# Altium project SUBBOARD-EMC_input.PrjPcb
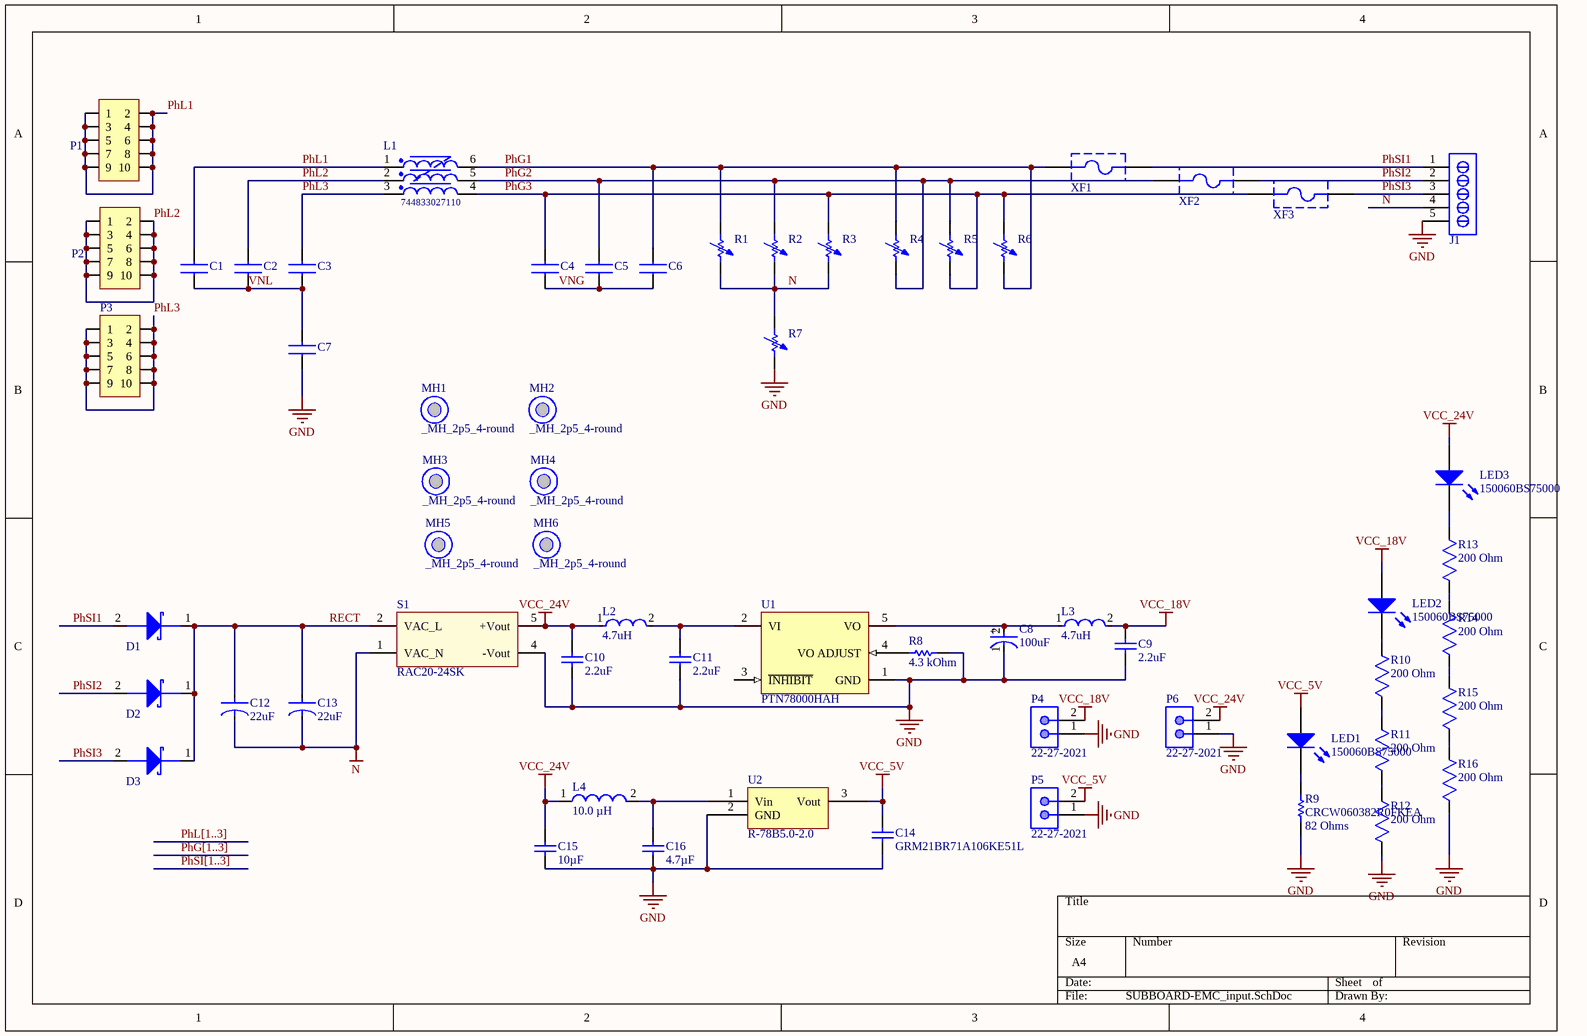
[diagram p0: SUBBOARD-EMC_input.SchDoc]
1 sheet, 61 parts. Net scope: global (net labels, ports and power ports of the same name join across sheets).
Board file: SUBBOARD-EMC_input.PcbDoc

## Sheet SUBBOARD-EMC_input.SchDoc
size A4

### Parts
C1  PHE840MZ7100MF11R06L2  [PHE840MZ7100MF11R06L2]  (value not drawn)
C2  PHE840MZ7100MF11R06L2  [PHE840MZ7100MF11R06L2]  (value not drawn)
C3  PHE840MZ7100MF11R06L2  [PHE840MZ7100MF11R06L2]  (value not drawn)
C4  PHE840MZ7100MF11R06L2  [PHE840MZ7100MF11R06L2]  (value not drawn)
C5  PHE840MZ7100MF11R06L2  [PHE840MZ7100MF11R06L2]  (value not drawn)
C6  PHE840MZ7100MF11R06L2  [PHE840MZ7100MF11R06L2]  (value not drawn)
C7  PHE850ER7100MR03R06L2  [PHE850ER7100MR03R06L2]  (value not drawn)
C8  Capacitance: 100uF  [FP-EEE-FK1H101P-MFG]  (hidden comment: EEE-FK1H101P)
C9  Capacitance: 2.2uF  [CAPC3225X140X50ML20T25]  (hidden comment: C1210C225K5RACTU)
C10  Capacitance: 2.2uF  [CAPC3225X140X50ML20T25]  (hidden comment: C1210C225K5RACTU)
C11  Capacitance: 2.2uF  [CAPC3225X140X50ML20T25]  (hidden comment: C1210C225K5RACTU)
C12  Capacitance: 22uF  [EEV-EB2W220M]  (hidden comment: EEV-EB2W220M)
C13  Capacitance: 22uF  [EEV-EB2W220M]  (hidden comment: EEV-EB2W220M)
C14  GRM21BR71A106KE51L  [CAPC2013X140X45NL15T25]
C15  Capacitance: 10µF  [CAPC3225X270X60LL30T30]  (hidden comment: UMK325BJ106KM-T)
C16  Capacitance: 4.7µF  [CAPC3216X180X55LL20T30]  (hidden comment: UMK316AB7475KL-T)
D1  BYG23T-M3/TR  [BYG23T-M3/TR]  (value not drawn)
D2  BYG23T-M3/TR  [BYG23T-M3/TR]  (value not drawn)
D3  BYG23T-M3/TR  [BYG23T-M3/TR]  (value not drawn)
J1  1715750  [SHDR5W110P0X500_1X5_2532X980X1380P]  (value not drawn)
L1  744833027110  [WE-TPB_Type 3XL_744833027110]
L2  Inductance: 4.7uH  [FP-IHLP-1616BZ-FP_1_8545x-MFG]  (hidden comment: IHLP1616BZER4R7M11)
L3  Inductance: 4.7uH  [FP-IHLP-1616BZ-FP_1_8545x-MFG]  (hidden comment: IHLP1616BZER4R7M11)
L4  Inductance: 10.0 µH  [WE-PD-M-PB]  (hidden comment: 744777910)
LED1  150060BS75000  [0603_A]
LED2  150060BS75000  [0603_A]
LED3  150060BS75000  [0603_A]
MH1  _MH_2p5_4-round  [_MH_2p5_4-round]
MH2  _MH_2p5_4-round  [_MH_2p5_4-round]
MH3  _MH_2p5_4-round  [_MH_2p5_4-round]
MH4  _MH_2p5_4-round  [_MH_2p5_4-round]
MH5  _MH_2p5_4-round  [_MH_2p5_4-round]
MH6  _MH_2p5_4-round  [_MH_2p5_4-round]
P1  IPT1-105-01-S-D-RA  [IPT1-105-01-S-D-RA]  (value not drawn)
P2  IPT1-105-01-S-D-RA  [IPT1-105-01-S-D-RA]  (value not drawn)
P3  IPT1-105-01-S-D-RA  [IPT1-105-01-S-D-RA]  (value not drawn)
P4  22-27-2021  [MOLX-22-27-2021_V]
P5  22-27-2021  [MOLX-22-27-2021_V]
P6  22-27-2021  [MOLX-22-27-2021_V]
R1  VDRS07H300BSE  [VISH-VDRS07-53x22-2_V]  (value not drawn)
R2  VDRS07H300BSE  [VISH-VDRS07-53x22-2_V]  (value not drawn)
R3  VDRS07H300BSE  [VISH-VDRS07-53x22-2_V]  (value not drawn)
R4  VDRS07H300BSE  [VISH-VDRS07-53x22-2_V]  (value not drawn)
R5  VDRS07H300BSE  [VISH-VDRS07-53x22-2_V]  (value not drawn)
R6  VDRS07H300BSE  [VISH-VDRS07-53x22-2_V]  (value not drawn)
R7  VDRS07H300BSE  [VISH-VDRS07-53x22-2_V]  (value not drawn)
R8  value 4.3 kOhm  [RESC2013X60X40LL20T25]  (hidden comment: ERA6AEB432V)
R9  CRCW060382R0FKEA  value 82 Ohms  [RESC1609X50X30LL10T20]
R10  200 Ohm  [CRCW0603200RFKEAHP]
R11  200 Ohm  [CRCW0603200RFKEAHP]
R12  200 Ohm  [CRCW0603200RFKEAHP]
R13  200 Ohm  [CRCW0603200RFKEAHP]
R14  200 Ohm  [CRCW0603200RFKEAHP]
R15  200 Ohm  [CRCW0603200RFKEAHP]
R16  200 Ohm  [CRCW0603200RFKEAHP]
S1  RAC20-24SK  [RAC20-K]
U1  PTN78000HAH  [EUS0005A]
U2  R-78B5.0-2.0  [R-78B5.0-2.0]
XF1  696108003002  [696108003002]  (value not drawn)
XF2  696108003002  [696108003002]  (value not drawn)
XF3  696108003002  [696108003002]  (value not drawn)

### Nets
GND: C7.2 C8.1(C) C9.2 C10.2 C11.2 C14.1 C15.2 C16.2 J1.5 P4.1 P5.1 P6.1 R7.2 R8.1 R9.2 R12.1 R16.1 S1.4(-Vout) U1.1(GND) U2.2(GND)
N: C12.2 C13.2 J1.4 R1.2 R2.2 R3.2 R7.1 S1.1(VAC_N)
VCC_5V: C14.2 LED1.2(A) P5.2 U2.3(Vout)
VCC_18V: C9.1 L3.2 LED2.2(A) P4.2
VCC_24V: C10.1 C15.1 L2.1 L4.1 LED3.2(A) P6.2 S1.5(+Vout)
PhG1: C6.1 L1.6 R1.1 R4.1 R6.2 XF1.1
PhG2: C5.1 L1.5 R2.1 R4.2 R5.1 XF2.1
PhG3: C4.1 L1.4 R3.1 R5.2 R6.1 XF3.1
PhL1: C1.1 L1.1 P1.1 P1.2 P1.3 P1.4 P1.5 P1.6 P1.7 P1.8 P1.9 P1.10
PhL2: C2.1 L1.2 P2.1 P2.2 P2.3 P2.4 P2.5 P2.6 P2.7 P2.8 P2.9 P2.10
PhL3: C3.1 L1.3 P3.1 P3.2 P3.3 P3.4 P3.5 P3.6 P3.7 P3.8 P3.9 P3.10
PhSI1: D1.2(Anode) J1.1 XF1.2
PhSI2: D2.2(Anode) J1.2 XF2.2
PhSI3: D3.2(Anode) J1.3 XF3.2
RECT: C12.1 C13.1 D1.1(Cathode) D2.1(Cathode) D3.1(Cathode) S1.2(VAC_L)
VNG: C4.2 C5.2 C6.2
VNL: C1.2 C2.2 C3.2 C7.1
NetC8_2: C8.2(A) L3.1 U1.5(VO)
NetC11_1: C11.1 L2.2 U1.2(VI)
NetC16_1: C16.1 L4.2 U2.1(Vin)
NetLED1_1: LED1.1(K) R9.1
NetLED2_1: LED2.1(K) R10.2
NetLED3_1: LED3.1(K) R13.2
NetR8_2: R8.2 U1.4(VO_ADJUST)
NetR10_1: R10.1 R11.2
NetR11_1: R11.1 R12.2
NetR13_1: R13.1 R14.2
NetR14_1: R14.1 R15.1
NetR15_2: R15.2 R16.2

Not connected (* = marked no-connect by the designer): U1 3(~{INHIBIT})

### Buses and harness runs
bus PhG[1..3]
bus PhL[1..3]
bus PhSI[1..3]

### Notes on the sheet
- (in symbol CMP-05427-000005-1) +

### Library data of the parts
C1-C6 = PHE840MZ7100MF11R06L2: CAP FILM 1UF 20% 760VDC RADIAL; Manufacturer: KEMET; Dielectric Material: PP; Voltage: 760V; Dissipation Factor: 0.4%; Voltage Rating (AC): 280V; Lead Length: 30mm; Lead Diameter: 0.8mm; Manufacturer Part Number: PHE840MZ7100MF11R06L2; RoHS: Yes; Category: Film Capacitors; Stock 1: 496; Pricing 1: 1=2,83000, 10=2,28500, 50=1,99440, 100=1,74500, 500=1,32954, 1000=1,16335, 2500=1,12180, 5000=1,09338 (USD); Mount: Through Hole; Case/Package: Radial; Number of Pins: 2; Min Operating Temperature: -55°C; Max Operating Temperature: 105°C; Dielectric: PP; Termination: Radial; Capacitance: 1uF; Tolerance: 20%; Packaging: Tray; Package Quantity: 216; Voltage Rating (DC): 760V; Length: 31.5mm; Height: 20.5mm; Lead Pitch: 27.5mm; Height - Seated (Max): 0.807inch; Depth: 10.5mm; Width: 0.413inch; Radiation Hardening: No; ComponentLink1URL: https://datasheet.ciiva.com/241/phe840m20series-241827.pdf?src-supplier=Digi-Key; ComponentLink1Description: https://datasheet.ciiva.com/241/phe840m20series-241827.pdf?src-supplier=Digi-Key; ComponentLink2URL: https://datasheet.ciiva.com/17239/datasheetpn-f840fe105m275c-17239253.pdf?src-supplier=Avnet+Europe; ComponentLink2Description: https://datasheet.ciiva.com/17239/datasheetpn-f840fe105m275c-17239253.pdf?src-supplier=Avnet+Europe; ComponentLink3URL: https://datasheet.ciiva.com/14589/70096376-14589271.pdf?src-supplier=Allied+Electronics; ComponentLink3Description: https://datasheet.ciiva.com/14589/70096376-14589271.pdf?src-supplier=Allied+Electronics; ComponentLink4URL: https://datasheet.ciiva.com/13403/f3294-phe840m-540905-13403690.pdf?src-supplier=Mouser; ComponentLink4Description: https://datasheet.ciiva.com/13403/f3294-phe840m-540905-13403690.pdf?src-supplier=Mouser; Supplier 1: Digi-Key; Supplier 2: Newark; Supplier 3: Arrow; Supplier 4: Mouser; Supplier 5: Allied Electronics; Supplier Part Number 5: 70096381; Supplier Part Number 4: 80-PHE840MZ7100MF11R; Supplier Part Number 3: PHE840MZ7100MF11R06L2; Supplier Part Number 2: 61M2385; Supplier Part Number 1: 399-5431-ND
C7 = PHE850ER7100MR03R06L2: CAP FILM 1UF 20% 1.25KVDC RADIAL; Manufacturer: KEMET; Dielectric Material: PP; Voltage Rating (AC): 300V; Voltage Rating (DC): 1.25kV; Lead Diameter: 1mm; Manufacturer Part Number: PHE850ER7100MR03R06L2; RoHS: Yes; Category: Film Capacitors; Stock 1: 10227; Pricing 1: 1=5,26000, 10=4,73700, 50=4,10560, 100=3,57930, 500=2,94768, 1000=2,77038 (USD); Mount: Through Hole; Case/Package: Radial; Min Operating Temperature: -55°C; Max Operating Temperature: 110°C; Dielectric: PP; Termination: Radial; Capacitance: 1uF; Tolerance: 20%; Packaging: Tray; Voltage: 1.25kV; Package Quantity: 91; Voltage Rating: 300V; Length: 41mm; Height: 19mm; Lead Pitch: 37.5mm; Width: 36mm; Height - Seated (Max): 1.417inch; Depth: 19mm; Radiation Hardening: No; Lead Free: Lead Free; ComponentLink1URL: https://datasheet.ciiva.com/11791/0900766b807a221a-11791526.pdf?src-supplier=RSComponents; ComponentLink1Description: https://datasheet.ciiva.com/11791/0900766b807a221a-11791526.pdf?src-supplier=RSComponents; ComponentLink2URL: https://datasheet.ciiva.com/241/f3294-phe850-241880.pdf?src-supplier=Digi-Key; ComponentLink2Description: https://datasheet.ciiva.com/241/f3294-phe850-241880.pdf?src-supplier=Digi-Key; Supplier 1: Digi-Key; Supplier 2: RSComponents; Supplier 3: Mouser; Supplier Part Number 2: 6168017; Supplier Part Number 1: 399-5425-ND; Supplier Part Number 3: 80-PHE850ER7100MR03
C8 = CMP-05427-000005-1: CAP ALUM 100UF 20% 50V SMD; Manufacturer: Panasonic Electronic Components; Automotive Grade: Grade 2; Dissipation Factor: 10%; Life: 2000Hours; Ripple Current: 350mA; Material: Aluminum; Esr: 0.34Ω; Leakage Current: 50uA; Tolerance: 20%; Package: 0; ComponentLink2URL: https://industrial.panasonic.com/cdbs/www-data/pdf/RDE0000/ABA0000C1181.pdf; Manufacturer Part Number: EEE-FK1H101P; Temperature Range Low: -55°C; Voltage Rating: 50V; ComponentLink2Description: Datasheet; Category: Cap; Digikey Description: CAP ALUM 100UF 20% 50V SMD; Octopart: https://octopart.com/eeefk1h101p-panasonic-4642841; Automotive: Yes; Temperature: -55°C to +105°C; Lead Free: Yes; Mouser Description: Cap Aluminum Lytic 100uF 50V 20% (8 X 10.2mm) SMD 350mA 2000h 105C Automotive T/R; Height: 10.5mm; Device Class L3: Aluminum Electrolytic Capacitors; Value: 100uF; Device Class L1: Passive Components; RoHS: TRUE; Device Class L2: Capacitors; Temperature Range High: +105°C
C9-C11 = CMP-2000-06019-1: Chip Capacitor, 2.2 uF, +/- 10%, 50 V, -55 to 125 degC, 1210 (3225 Metric), RoHS, Tape and Reel; Manufacturer: Kemet; Dielectric: X7R; Voltage Rating: 50V; Type: SMDMLCCX7R6.3-250VDCCommericalGrade; Capacitance - nF: 2200nF; Case Height: 1.25mm; Case Width: 2.5mm; Class: Class1; Case Length: 3.2mm; Temperature Coefficient / Code: +/-15%; Manufacturer URL: http://www.kemet.com/; Series: C1210C; Mounting Technology: SurfaceMount; Case Code - in: 1210; Factory Pack Quantity: 2500; Package Reference: 1210; Product: GeneralTypeMLCCs; Datasheet Version: 02/2016; Datasheet URL: http://www.kemet.com/docfinder?Partnumber=C1210C225K5RACTU; Case Code - mm: 3225; Minimum Operating Temperature: -55C; Voltage Rating DC: 50V; Maximum Operating Temperature: +125C; Termination Style: SMD/SMT; Tolerance: 10%; Dimensions: 2.5mmWx3.2mmLx1.25mmH; Operating Temperature Range: -55Cto+125C; Product Category: MultilayerCeramicCapacitorsMLCC-SMD/SMT; Package / Case: 1210(3225metric); RoHS: Details; Package Description: 2-Pin Surface Mount Device, Body 3.2 x 2.5 mm; Brand: Kemet; Packaging: Reel
C12 C13 = EEV-EB2W220M: CAP, ALU ELEC, 22UF, 450V, SMD; Manufacturer: Panasonic; Dielectric Material: Aluminium; Tolerance: 20%; Ripple Current: 560mA; Life (Hours): 5000Hour; Leakage Current: 604uA; Lead Length: 6.7mm; Manufacturer Part Number: EEV-EB2W220M; RoHS: Yes; Category: Aluminum Electrolytic Capacitors; Stock 1: 806; Pricing 1: 1=3,73000, 10=3,00800 (USD); Mount: Surface Mount,PCB; Case/Package: Radial; Number of Pins: 21; Min Operating Temperature: -25°C; Max Operating Temperature: 105°C; Packaging: Tape and Reel; Voltage Rating: 450V; Voltage Rating (DC): 450V; Termination: SMD/SMT; Package Quantity: 1; Voltage: 450V; Ripple Current (AC): 560mA; Diameter: 18mm; Length: 21.5mm; Height: 21.5mm; Height - Seated (Max): 0.846inch; Lead Pitch: 6.7mm; Width: 1.2mm; Radiation Hardening: No; REACH SVHC: No SVHC; Lead Free: Lead Free; ComponentLink1URL: https://datasheet.ciiva.com/94/aba0000ce11-94804.pdf?src-supplier=Digi-Key; ComponentLink1Description: https://datasheet.ciiva.com/94/aba0000ce11-94804.pdf?src-supplier=Digi-Key; ComponentLink2URL: https://datasheet.ciiva.com/94/aba0000ce11-94805.pdf?src-supplier=Digi-Key; ComponentLink2Description: https://datasheet.ciiva.com/94/aba0000ce11-94805.pdf?src-supplier=Digi-Key; ComponentLink3URL: https://datasheet.ciiva.com/26823/getdatasheetpartid-52298-26823205.pdf?src-supplier=Verical; ComponentLink3Description: https://datasheet.ciiva.com/26823/getdatasheetpartid-52298-26823205.pdf?src-supplier=Verical; ComponentLink4URL: https://datasheet.ciiva.com/94/aba0000ce11-94806.pdf?src-supplier=Digi-Key; ComponentLink4Description: https://datasheet.ciiva.com/94/aba0000ce11-94806.pdf?src-supplier=Digi-Key; ComponentLink5URL: https://datasheet.ciiva.com/14594/70257799-14594134.pdf?src-supplier=Allied+Electronics; ComponentLink5Description: https://datasheet.ciiva.com/14594/70257799-14594134.pdf?src-supplier=Allied+Electronics; ComponentLink6URL: https://datasheet.ciiva.com/8081/aba0000ce11-8081608.pdf?src-supplier=Element14; ComponentLink6Description: https://datasheet.ciiva.com/8081/aba0000ce11-8081608.pdf?src-supplier=Element14; ComponentLink7URL: https://datasheet.ciiva.com/46379/1678957-46379208.pdf?src-supplier=Element14; ComponentLink7Description: https://datasheet.ciiva.com/46379/1678957-46379208.pdf?src-supplier=Element14; ComponentLink8URL: https://datasheet.ciiva.com/14603/70257799-14603849.pdf?src-supplier=Allied+Electronics; ComponentLink8Description: https://datasheet.ciiva.com/14603/70257799-14603849.pdf?src-supplier=Allied+Electronics; ComponentLink9URL: https://datasheet.ciiva.com/31418/1678957-31418299.pdf?src-supplier=Farnell; ComponentLink9Description: https://datasheet.ciiva.com/31418/1678957-31418299.pdf?src-supplier=Farnell; ComponentLink10URL: https://datasheet.ciiva.com/46372/1678957-46372111.pdf?src-supplier=Element14; ComponentLink10Description: https://datasheet.ciiva.com/46372/1678957-46372111.pdf?src-supplier=Element14; Supplier 1: Digi-Key; Supplier 2: Digi-Key; Supplier 3: Digi-Key; Supplier 4: Newark; Supplier 5: Mouser; Supplier 6: Farnell; Supplier Part Number 6: 2326352; Supplier Part Number 5: 667-EEV-EB2W220M; Supplier Part Number 4: 85Y5181; Supplier Part Number 3: PCE3598TR-ND; Supplier Part Number 2: PCE3598DKR-ND; Supplier Part Number 1: PCE3598CT-ND
C14 = CMP-2007-03395-1: Manufacturer: Murata; Part Number: GRM21BR71A106KE51L
C15 = CMP-2000-07360-1: Chip Capacitor, 10 uF, +/- 10%, 50 V, -55 to 85 degC, 1210 (3225 Metric), RoHS, Tape and Reel; Manufacturer: Taiyo Yuden; Catalog Drawings: xMKSeries_1210_2.5; Other Names: 587-2247-2CEUMK325BJ106KM-TQ4177041UMK325BJ106KM-T-NDUMK325BJ106KMT; Online Catalog: MSeries; Voltage - Rated: 50V; Temperature Coefficient: X5R; Tolerance: ±10%; Packaging: Tape&Reel(TR); Features: -; Applications: GeneralPurpose; Series: M; Manufacturer URL: http://www.t-yuden.com/; Package Description: 2-Pin Surface Mount Device, Body 3.2 x 2.5 mm; Package Reference: 1210; Standard Package: 500; Mounting Technology: SurfaceMount; Family: CeramicCapacitors; Thickness (Max): 0.106"(2.70mm); Height - Seated (Max): -; Datasheet URL: https://datasheet.ciiva.com/30051/155umk325bj106km-t-30051915.pdf; Datasheet Version: 05/2014; Operating Temperature: -55°C~85°C; Lead Spacing: -; Package / Case: 1210(3225Metric); Mounting Type: SurfaceMount,MLCC; Size / Dimension: 0.126"Lx0.098"W(3.20mmx2.50mm); Category: Capacitors; Ratings: -; Lead Style: -
C16 = CMP-2000-07358-1: Chip Capacitor, 4.7 uF, +/- 10%, 50 V, -55 to 125 degC, 1206 (3216 Metric), RoHS, Tape and Reel; Manufacturer: Taiyo Yuden; Other Names: 587-2994-6; Temperature Coefficient: X7R; Online Catalog: MSeries; Voltage - Rated: 50V; Catalog Drawings: xMKSeries_1206_1.6; Height - Seated (Max): -; Mounting Technology: SurfaceMount; Tolerance: ±10%; Datasheet Version: 02/2016; Category: Capacitors; Manufacturer URL: http://www.t-yuden.com/; Series: M; Thickness (Max): 0.071"(1.80mm); Package / Case: 1206(3216Metric); Lead Spacing: -; Applications: GeneralPurpose; Package Description: 2-Pin Surface Mount Device, Body 3.2 x 1.6 mm; Package Reference: 1206; Ratings: -; Mounting Type: SurfaceMount,MLCC; Standard Package: 1; Size / Dimension: 0.126"Lx0.063"W(3.20mmx1.60mm); Lead Style: -; Packaging: Digi-Reel®; Datasheet URL: http://datasheet.octopart.com/UMK316AB7475KL-T-Taiyo-Yuden-datasheet-62109650.pdf; Voltage Rating DC: 50V; Operating Temperature: -55°C~125°C; Features: -; Family: CeramicCapacitors
D1-D3 = BYG23T-M3/TR: DIODE AVALANCHE 1300V 1A DO214AC; Manufacturer: Vishay Semiconductors; Max Surge Current: 18A; Forward Voltage: 1.9V; Peak Reverse Current: 5uA; Recovery Time: 75ns; Max Repetitive Reverse Voltage (Vrrm): 1.3kV; Zener Voltage: 200V; Max Power Dissipation: 800mW; Element Configuration: Single; Supplier 1: Newark; Manufacturer Part Number: BYG23T-M3/TR; RoHS: Yes; Category: Rectifier Diodes; Stock 1: 6980; Pricing 1: 1=0.16100, 10=0.16100, 25=0.16100, 50=0.16100, 100=0.16100, 250=0.16100, 500=0.16100, 1000=0.14800 (USD); Mount: Surface Mount; Case/Package: SMA; Number of Pins: 2; Contact Plating: Tin,Matte; Min Operating Temperature: -55°C; Max Operating Temperature: 150°C; Packaging: Tape and Reel; Forward Current: 1A; Package Quantity: 1; Average Rectified Current: 1A; Reverse Recovery Time: 75ns; Max Forward Surge Current (Ifsm): 18A; Peak Non-Repetitive Surge Current: 18A; Diode Type: Avalanche; Max Reverse Voltage (DC): 1.3kV; Reverse Voltage: 1.3kV; Length: 4.5mm; Height: 2.29mm; Width: 2.79mm; Radiation Hardening: No; REACH SVHC: Unknown; ComponentLink1URL: https://datasheet.ciiva.com/23642/byg23t-23642320.pdf?src-supplier=Newark; ComponentLink1Description: https://datasheet.ciiva.com/23642/byg23t-23642320.pdf?src-supplier=Newark; ComponentLink2URL: https://datasheet.ciiva.com/30479/0900766b810d43bd-30479333.pdf?src-supplier=RSComponents; ComponentLink2Description: https://datasheet.ciiva.com/30479/0900766b810d43bd-30479333.pdf?src-supplier=RSComponents; ComponentLink3URL: https://datasheet.ciiva.com/4454/byg23t-85630-4454047.pdf?src-supplier=Mouser; ComponentLink3Description: https://datasheet.ciiva.com/4454/byg23t-85630-4454047.pdf?src-supplier=Mouser; ComponentLink4URL: https://datasheet.ciiva.com/920/byg23t-920130.pdf?src-supplier=Digi-Key; ComponentLink4Description: https://datasheet.ciiva.com/920/byg23t-920130.pdf?src-supplier=Digi-Key; ComponentLink5URL: https://datasheet.ciiva.com/920/byg23t-920131.pdf?src-supplier=Digi-Key; ComponentLink5Description: https://datasheet.ciiva.com/920/byg23t-920131.pdf?src-supplier=Digi-Key; ComponentLink6URL: https://datasheet.ciiva.com/920/byg23t-920132.pdf?src-supplier=Digi-Key; ComponentLink6Description: https://datasheet.ciiva.com/920/byg23t-920132.pdf?src-supplier=Digi-Key; ComponentLink7URL: https://datasheet.ciiva.com/1178/byg23t-1178213.pdf?src-supplier=Element14; ComponentLink7Description: https://datasheet.ciiva.com/1178/byg23t-1178213.pdf?src-supplier=Element14; Supplier Part Number 1: 70AC6454
J1 = 1715750: Phoenix Contact MKDS 1.5/ 5-5.08, 5 Way PCB Terminal Block; Current Rating: 17.5A; Voltage Rating: 400V; Number of Levels: 1; Number of Positions Per Level: 5; Current: 15A; Voltage: 300V; Connector Type: Screw; Wire Gauge (Max): 30AWG; Wire Gauge (Min): 14AWG; Pitch: 0.2inch; Supplier 1: Digi-Key; Manufacturer: Phoenix Contact; Manufacturer Part Number: 1715750; RoHS: Yes; Category: Terminal Blocks; Stock 1: 212; Pricing 1: 1=3.30000, 10=3.16400, 50=3.02620, 100=2.94360, 250=2.75100, 500=2.53092, 1000=2.33834, 2500=2.22832, 5000=2.09077 (USD); Mount: Through Hole; Number of Pins: 5; Weight: 1.269863oz; Contact Material: Tin; Color: Green; Housing Color: Green; Housing Material: Nylon; Package Quantity: 50; Packaging: Bulk; Termination: Screw; Number of Positions: 5; Length: 9.8mm; Height: 17.3mm; Width: 27.94mm; ComponentLink1URL: https://datasheet.ciiva.com/26340/788258-da-01-en-printklemme-1715750-250-st-26340992.pdf?src-supplier=Conrad; ComponentLink1Description: https://datasheet.ciiva.com/26340/788258-da-01-en-printklemme-1715750-250-st-26340992.pdf?src-supplier=Conrad; Supplier Part Number 1: 277-13762-ND
L1 = 744833027110: WE-TPB Common Mode Power Line Choke, Type 3XL, 2.7mH, 11A, 500V; Manufacturer: Wurth Elektronik; DC Resistance max.: 18mOhm; Insulation Test Voltage: 2500VAC; Rated Voltage: 500VAC; ComponentLink1Description: Manufacturer; ComponentLink1URL: http://www.we-online.de; ComponentLink2Description: Datasheet; ComponentLink2URL: https://www.we-online.com/catalog/datasheet/744833027110.pdf; Manufacturer Part Number: 744833027110; Published Date: April 2020; Operating Temperature: -40 to +125degC; Mounting Technology: THT; Packaging: Tray and Carton; Inductance: 2.7mH; Rated Current: 11A; Size: Type 3XL; Supplier 1: Digi-Key; Supplier 2: Newark; Supplier 3: Mouser; Supplier 4: Farnell; Supplier Part Number 1: 732-13597-ND; Supplier Part Number 2: 28AH8224; Supplier Part Number 3: 710-744833027110; Supplier Part Number 4: 3221513
L2 L3 = CMP-02424-000576-1: Fixed Inductors Commercial Low DCR Series SMT 4.7uH 1.7A 105mΩ 20%; Saturation Current: 1.75A; Test Frequency: 100kHz; Shielding: Shielded; Self Resonant Frequency: 29MHz; Core Material: Ferrite; DC Resistance (DCR): 105mR; Width: 4.06mm; Depth: 4.31mm; Height: 2mm; Case/Package: 1616; Max DC Current: 1.7A; Max Operating Temperature: 125°C; Inductance Tolerance: 20%; Current Rating: 1.7A; Package Quantity: 4000; Tolerance: 20%; Length: 4.7mm; Contact Plating: Tin; RMS Current (Irms): 1.7A; Packaging: Tape and Reel; Height - Seated (Max): 0.079inch; Military Standard: Not; Termination: SMD/SMT; Mount: Surface Mount; Number of Pins: 1616; Min Operating Temperature: -55°C; Lead Free: Lead Free; Radiation Hardening: No
L4 = CMP-0227-00229-1: SMD-Shielded Power Inductor WE-PD, L = 10.0 µH; ComponentLink2Description: Datasheet; PackageReference: WE-PD-M-PB; PackageDescription: SMD Inductor, 2-Leads, Body 7.3 x 7.3 mm; ComponentLink1URL: http://www.we-online.com; PackageVersion: 2008; ComponentLink1Description: Manufacturer Link; ComponentLink2URL: http://www.we-online.de/katalog/media/pdf/744777910.pdf; DatasheetVersion: ver 10, Jan-2008
LED1-LED3 = CMP-1426-00003-1: SMD mono-color Chip LED, WL-SMCW, Blue; Manufacturer: Wuerth Elektronik; Color: Blue; ComponentLink2Description: Datasheet; ComponentLink2URL: http://katalog.we-online.com/led/datasheet/150060BS75000.pdf; ComponentLink1URL: http://www.we-online.com; PackageReference: 0603_A; PartNumber: 150060BS75000; ComponentLink1Description: Manufacturer URL
MH1-MH6 = _MH_2p5_4-round: matching hole 2.5 hole, 4mm pad (round)
P1-P3 = IPT1-105-01-S-D-RA: CONN PLUG .100" 10POS DL PCB R/A; Manufacturer: Samtec; Number of Contacts: 10; Gender: Male; Connector Type: Male Pin; Number of Ports: 1; Max Voltage Rating (AC): 550V; Max Current Rating: 8A; Pitch: 2.54mm; Row Spacing: 0.1inch; Supplier 1: Digi-Key; Manufacturer Part Number: IPT1-105-01-S-D-RA; RoHS: Yes; Category: Connectors; Stock 1: 449; Pricing 1: 1=3.53000, 10=3.38400, 100=2.82000, 500=2.39700, 1000=2.04450, 5000=1.83300 (USD); Mount: Through Hole; Contact Material: Bronze; Contact Plating: Gold; Housing Material: Polymer; Number of Terminals: 10; Housing Color: Black; Color: Black; Min Operating Temperature: -55°C; Max Operating Temperature: 125°C; Termination: Solder; Orientation: Right Angle; Packaging: Rail/Tube; Number of Rows: 2; Number of Positions: 10; Length: 13.21mm; Depth: 10.39mm; Contact Mating Length: 0.155inch; Radiation Hardening: No; REACH SVHC: No SVHC; Lead Free: Lead Free; ComponentLink1URL: https://datasheet.ciiva.com/716/ipt1-1xx-xx-xx-d-ra-xxx-mkt-716221.pdf?src-supplier=Digi-Key; ComponentLink1Description: https://datasheet.ciiva.com/716/ipt1-1xx-xx-xx-d-ra-xxx-mkt-716221.pdf?src-supplier=Digi-Key; ComponentLink2URL: https://datasheet.ciiva.com/7997/81376-7997581.pdf?src-supplier=Element14; ComponentLink2Description: https://datasheet.ciiva.com/7997/81376-7997581.pdf?src-supplier=Element14; ComponentLink3URL: https://datasheet.ciiva.com/9444/ipt1-9444638.pdf?src-supplier=Avnet; ComponentLink3Description: https://datasheet.ciiva.com/9444/ipt1-9444638.pdf?src-supplier=Avnet; Supplier Part Number 1: SAM8101-ND
P4-P6 = CMP-2000-05537-1: Male Header, Pitch 2.54 mm, 1 x 2 Position, Height 11.7 mm, Tail Length 3.56 mm, 0 to 75 degC, RoHS, Bulk; Manufacturer: Molex; PartNumber: 0022272021; Current rating: 4A; Package Version: Rev. BC, 02/2012; Voltage rating: 250V; No. of Positions: 2; Pitch: 2.54mm; No. of Rows: 1; Orientation: Vertical; Operating temperature: 0°Cto+75°C; Manufacturer URL: http://www.molex.com/; Mounting Technology: ThroughHole; Housing material: Nylon(UL94V-0); Package Description: 2-Leads Header, Body 5.08 x 5.8 mm, Pitch 2.54 mm; Voltage - Max: 250V; Datasheet URL: http://www.molex.com/pdm_docs/sd/022272021_sd.pdf; Package Reference: 22-27-2021; Contact material: Tinplatedbrass; Current - Max: 4A; Datasheet Version: Rev. F, 06/2009
R1-R7 = CMP-0954-00002-1: Metal Oxide Varistor, 300 V AC, 385 V DC, 40 J, -40 to 85 degC, 2-Pin 9 x 5.3 x 11 THD mm, RoHS, Bulk; Manufacturer: Vishay Semiconductor; Voltage @ 1 mA: 470 V; Typical CAP. @ 1 kHz: 130 pF; RMS: 300 V Max.; DC: 385 V Max.; Energy: 40 J Max.; Mounting Technology: Through Hole; PackageDescription: 2-Pin THD, Body 9 x 5.3 mm, Height 11 mm; ComponentLink1URL: http://www.vishay.com/; Packing: Bulk; ComponentLink1Description: Manufacturer URL; ComponentLink2URL: http://www.vishay.com/docs/29081/23815925.pdf; ComponentLink2Description: Datasheet; PackageReference: VDRS07-53x22-2; DatasheetVersion: Jun-10; PartNumber: VDRS07H300BSE; RoHS: TRUE; Temp. Range: -40 to 85 degC
R8 = CMP-2001-00639-1: Manufacturer: Panasonic; Part Number: ERA6AEB432V
R9 = CMP-2000-03606-1: Manufacturer: Vishay Dale; Part Number: CRCW060382R0FKEA
R10-R16 = CRCW0603200RFKEAHP: CRCW0603200RFKEAHP / Res Thick Film 0603 200 Ohm 1% 0.25W(1/4W) ±100ppm/C Pad SMD Automotive T/R; Manufacturer: Vishay Dale; Resistance: 200R; Power Rating: 250mW; Temperature Coefficient: 100ppm/°C; Supplier 1: Digi-Key; Manufacturer Part Number: CRCW0603200RFKEAHP; RoHS: Yes; Category: Chip SMD Resistors; Stock 1: 59007; Pricing 1: 1=0.15000, 10=0.12900, 100=0.05030, 1000=0.02106, 2500=0.01930 (USD); Mount: Surface Mount; Case/Package: 0603; Case Code (Imperial): 0603; Case Code (Metric): 1608; Contact Plating: Tin; Min Operating Temperature: -55°C; Max Operating Temperature: 155°C; Features: Automotive AEC-Q200; Tolerance: 1%; Packaging: Tape and Reel; Resistor Type: Thick Film; Max Power Dissipation: 250mW; Number of Terminations: 2; Package Quantity: 5000; Length: 0.063inch; Width: 0.033inch; Height: 0.022inch; Radiation Hardening: No; Lead Free: Lead Free; ComponentLink1URL: https://datasheet.ciiva.com/2578/crcwhpe3-2578537.pdf?src-supplier=Digi-Key; ComponentLink1Description: https://datasheet.ciiva.com/2578/crcwhpe3-2578537.pdf?src-supplier=Digi-Key; ComponentLink2URL: https://datasheet.ciiva.com/8961/crcwhpe3-8961129.pdf?src-supplier=Avnet; ComponentLink2Description: https://datasheet.ciiva.com/8961/crcwhpe3-8961129.pdf?src-supplier=Avnet; Supplier Part Number 1: 541-200SCT-ND
S1 = RAC20-24SK: 20 Watt 2'' x 1'' Single output 24VDC Regulated SMPS RAC20-24SK; Input Voltage Min: 85 VAC; Input Voltage Max: 264 VAC; Output current: 840 mA; Output Voltage: 24 VDC; Supplier 1: Mouser; Supplier Part Number 1: 919-RAC20-24SK
U1 = CMP-0387-00618-2: 1.5 A, Wide Input, Wide Output Adjust Module, -40 to 85 degC, 5-pin Module (EUS5), Pb-Free (RoHS); Manufacturer: Texas Instruments; Vout(Max)(V): 22; Iout(Max)(A): 1.5; SubFamily: Non-Isolated POL; Vin(Min)(V): 15; Vin(Max)(V): 36; Regulated Outputs(#): 1; VO Adjustable: TRUE; Vout(Min)(V): 11.85; Mounting Technology: Through Hole; DatasheetVersion: SLTS230C; ComponentLink3Description: Package Specification; PackageReference: EUS0005A; ComponentLink3URL: http://www.ti.com/litv/pdf/mpds139b; ComponentLink2URL: http://www.ti.com/general/docs/lit/getliterature.tsp?genericPartNumber=PTN78000H&fileType=pdf; ComponentLink4URL: Samples URL:http://www.ti.com/product/ptn78000h#samples; ComponentLink1Description: Manufacturer URL; PackageDescription: 5-Pin Plastic Special Shape, Body 12.57 x 18.92 mm; PackageVersion: 4204990-2/C; PartNumber: PTN78000HAH; ComponentLink2Description: Datasheet; Eco-Plan: Pb-Free (RoHS); ComponentLink1URL: http://www.ti.com/; ComponentLink4Description: URL Link1
U2 = R-78B5.0-2.0: DC DC CONVERTER 5V; Manufacturer: Recom; Manufacturer Part Number: R-78B5.0-2.0; RoHS: No; Category: Board Mount Modules; Stock 1: 498; Pricing 1: 1=9,98000, 5=9,79200, 10=9,71800, 25=9,56800, 50=9,26900, 100=8,55000, 250=8,22252, 500=8,07300 (USD); Weight: 4g; Max Output Voltage: 5V; Length: 11.5mm; Height: 17.5mm; Width: 8.5mm; ComponentLink1URL: http://www.farnell.com/datasheets/2787641.pdf?src-supplier=Farnell; ComponentLink1Description: http://www.farnell.com/datasheets/2787641.pdf?src-supplier=Farnell; ComponentLink2URL: http://www.farnell.com/datasheets/2229408.pdf?src-supplier=Farnell; ComponentLink2Description: http://www.farnell.com/datasheets/2229408.pdf?src-supplier=Farnell; ComponentLink3URL: https://www.recom-power.com/pdf/Innoline/R-78Bxx-2.0.pdf?src-supplier=Digi-Key; ComponentLink3Description: https://www.recom-power.com/pdf/Innoline/R-78Bxx-2.0.pdf?src-supplier=Digi-Key; Supplier 1: Digi-Key; Supplier 2: Newark; Supplier 3: Mouser; Supplier 4: RSComponents; Supplier 5: RSComponents; Supplier 6: Farnell; Supplier Part Number 1: 945-3042-ND; Supplier Part Number 2: 11AC9497; Supplier Part Number 3: 919-R-78B5.0-2.0; Supplier Part Number 4: 1392821; Supplier Part Number 5: 1392959; Supplier Part Number 6: 2747528
XF1-XF3 = 696108003002: FUSEHOLDER BLOCKS - PCB - CLIP C; Manufacturer: Wurth Electronics; Fuse Current: 10A; Voltage Rating (AC): 250V; Number of Circuits: 1; Current Rating: 20A; Supplier 1: Digi-Key; Manufacturer Part Number: 696108003002; RoHS: No; Category: Fuse Holders; Stock 1: 2780; Pricing 1: 1=0.64000, 10=0.60500, 50=0.57460, 100=0.51300, 250=0.45144, 500=0.36936 (USD); Mount: PCB; Contact Material: Copper Alloy; Contact Plating: Tin; Voltage: 250V; Orientation: Horizontal; Termination: PC Pin; REACH SVHC: Unknown; ComponentLink1URL: http://www.farnell.com/cad/1897313.pdf?src-supplier=Element14; ComponentLink1Description: http://www.farnell.com/cad/1897313.pdf?src-supplier=Element14; ComponentLink2URL: https://katalog.we-online.de/em/datasheet/696108003002.pdf?src-supplier=Digi-Key; ComponentLink2Description: https://katalog.we-online.de/em/datasheet/696108003002.pdf?src-supplier=Digi-Key; Supplier Part Number 1: 732-11376-ND